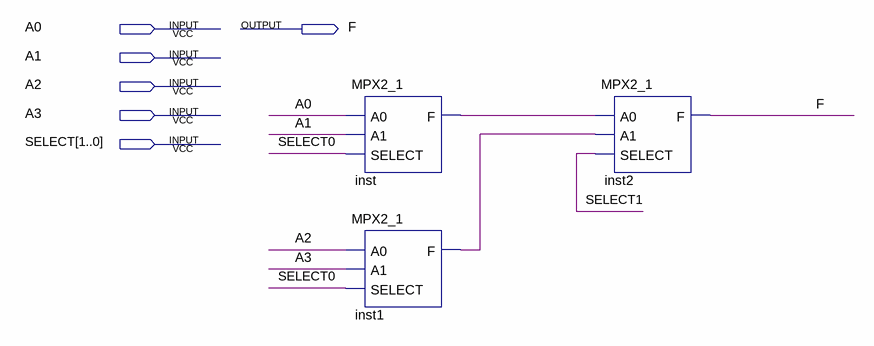
[diagram p0: schematic sheet]
// Quartus schematic MPX4_1.bdf as structural Verilog: 3 symbols, 6 pins
module MPX4_1 (
  input  A0,
  input  A1,
  input  A2,
  input  A3,
  input  [1:0] SELECT,
  output F
);

  wire inst1_f, inst_f;

  MPX2_1 inst (.A0(A0), .A1(A1), .SELECT(SELECT[0]), .F(inst_f));
  MPX2_1 inst1 (.A0(A2), .A1(A3), .SELECT(SELECT[0]), .F(inst1_f));
  MPX2_1 inst2 (.A0(inst_f), .A1(inst1_f), .SELECT(SELECT[1]), .F(F));
endmodule
